# Altium project IOEX V1R0.PrjPcb
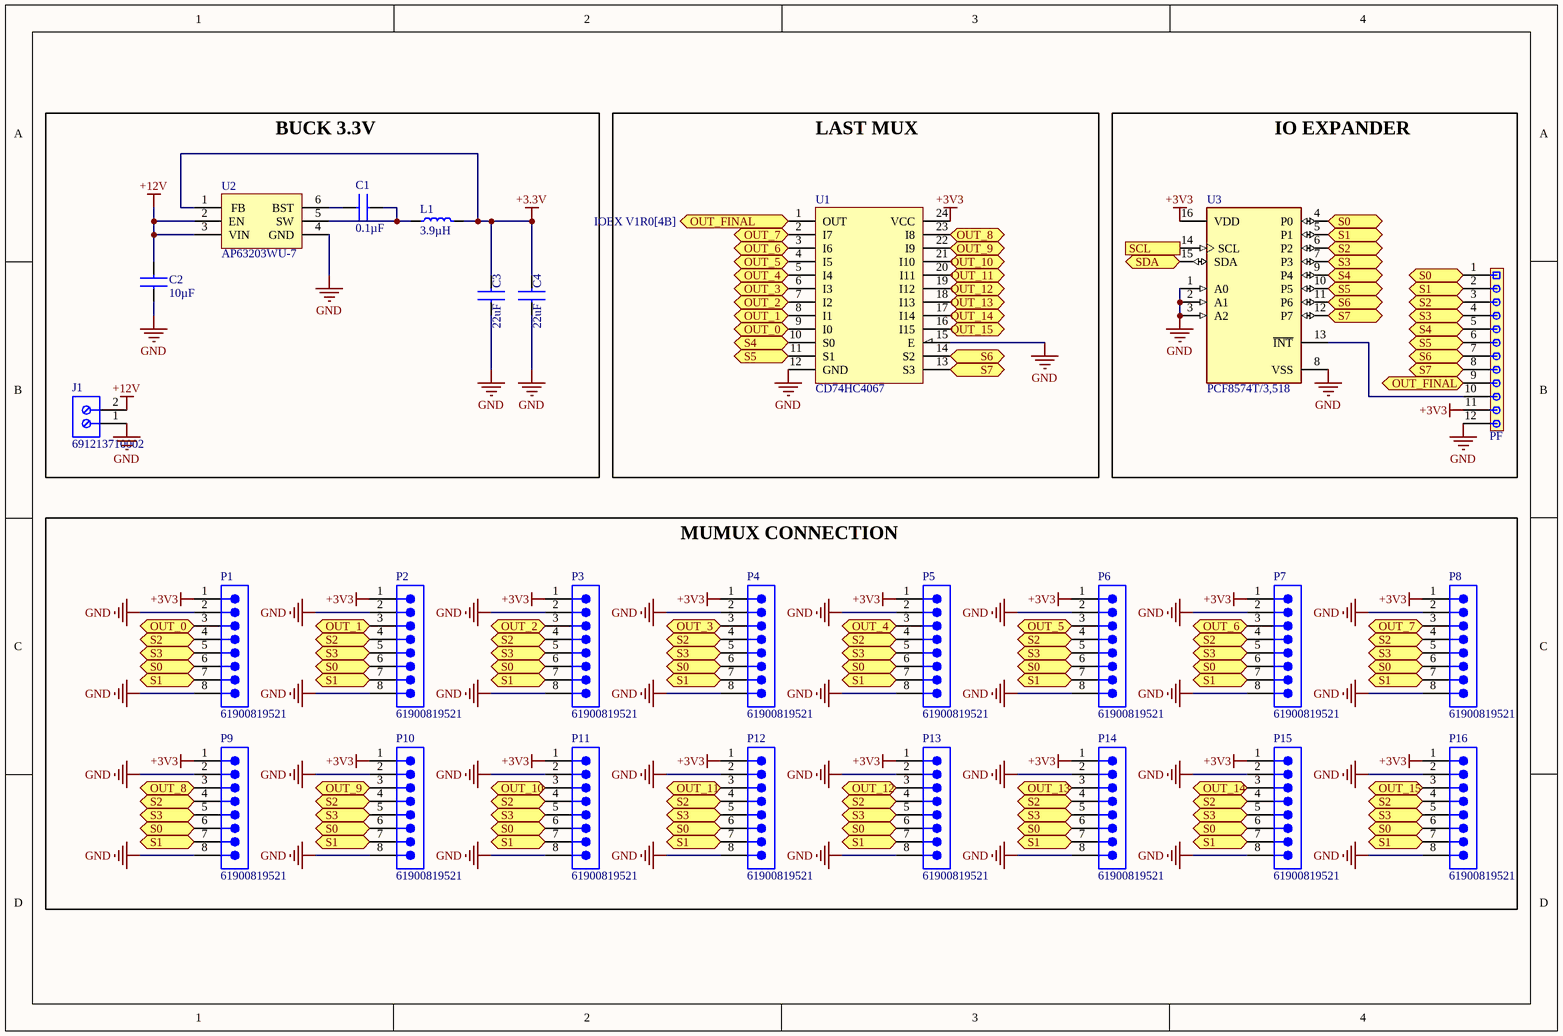
[diagram p0: IOEX V1R0.SchDoc]
1 sheet, 26 parts. Net scope: flat (ports and power ports of the same name join across sheets).
Board file: IOEX V1R0.PcbDoc

## Sheet IOEX V1R0.SchDoc
size A4; SheetNumber: 1; SheetTotal: 1

### Parts
C1  0.1µF  [0402-CAP]
C2  10µF  [0805-CAP]
C3  22uF  [0603-CAP]
C4  22uF  [0603-CAP]
J1  691213710002  [691213710002]
L1  3.9µH  [IND (4.8 x 4.8)]
P1  61900819521  [61900819521]
P2  61900819521  [61900819521]
P3  61900819521  [61900819521]
P4  61900819521  [61900819521]
P5  61900819521  [61900819521]
P6  61900819521  [61900819521]
P7  61900819521  [61900819521]
P8  61900819521  [61900819521]
P9  61900819521  [61900819521]
P10  61900819521  [61900819521]
P11  61900819521  [61900819521]
P12  61900819521  [61900819521]
P13  61900819521  [61900819521]
P14  61900819521  [61900819521]
P15  61900819521  [61900819521]
P16  61900819521  [61900819521]
PF  PH1-12-UA  [2057-PH1-12-UA-ND]  (value not drawn)
U1  CD74HC4067  [SOIC-24]
U2  AP63203WU-7  [SOT-23-6]
U3  PCF8574T/3,518  [FP-SOT162-1-MFG]

### Blocks framed on the sheet
BUCK 3.3V: C1-C4 J1 L1 U2
LAST MUX: U1
IO EXPANDER: PF U3
MUMUX CONNECTION: P1-P16

### Ports
OUT_0 (bidir, see IOEX V1R0[1C]), OUT_0 (bidir, see IOEX V1R0[2B]), OUT_1 (bidir, see IOEX V1R0[1C]), OUT_1 (bidir, see IOEX V1R0[2B]), OUT_2 (bidir, see IOEX V1R0[2B]), OUT_2 (bidir, see IOEX V1R0[2C]), OUT_3 (bidir, see IOEX V1R0[2B]), OUT_3 (bidir, see IOEX V1R0[2C]), OUT_4 (bidir, see IOEX V1R0[2B]), OUT_4 (bidir, see IOEX V1R0[3C]), OUT_5 (bidir, see IOEX V1R0[2B]), OUT_5 (bidir, see IOEX V1R0[3C]), OUT_6 (bidir, see IOEX V1R0[2A]), OUT_6 (bidir, see IOEX V1R0[4C]), OUT_7 (bidir, see IOEX V1R0[2A]), OUT_7 (bidir, see IOEX V1R0[4C]), OUT_8 (bidir, see IOEX V1R0[1D]), OUT_8 (bidir, see IOEX V1R0[3A]), OUT_9 (bidir, see IOEX V1R0[1D]), OUT_9 (bidir, see IOEX V1R0[3A]), OUT_10 (bidir, see IOEX V1R0[2D]), OUT_10 (bidir, see IOEX V1R0[3B]), OUT_11 (bidir, see IOEX V1R0[2D]), OUT_11 (bidir, see IOEX V1R0[3B]), OUT_12 (bidir, see IOEX V1R0[3B]), OUT_12 (bidir, see IOEX V1R0[3D]), OUT_13 (bidir, see IOEX V1R0[3B]), OUT_13 (bidir, see IOEX V1R0[3D]), OUT_14 (bidir, see IOEX V1R0[3B]), OUT_14 (bidir, see IOEX V1R0[4D]), OUT_15 (bidir, see IOEX V1R0[3B]), OUT_15 (bidir, see IOEX V1R0[4D]), OUT_FINAL (bidir, see IOEX V1R0[2A]), OUT_FINAL (bidir, see IOEX V1R0[4B]), S0 (bidir, see IOEX V1R0[1C], IOEX V1R0[1D], IOEX V1R0[2C], IOEX V1R0[2D], IOEX V1R0[3C], IOEX V1R0[3D], IOEX V1R0[4A], IOEX V1R0[4B], IOEX V1R0[4C], IOEX V1R0[4D]), S0 (bidir, see IOEX V1R0[1C], IOEX V1R0[1D], IOEX V1R0[2C], IOEX V1R0[2D], IOEX V1R0[3C], IOEX V1R0[3D], IOEX V1R0[4A], IOEX V1R0[4C], IOEX V1R0[4D]), S0 (bidir, see IOEX V1R0[1C], IOEX V1R0[1D], IOEX V1R0[2C], IOEX V1R0[2D], IOEX V1R0[3C], IOEX V1R0[3D], IOEX V1R0[4B], IOEX V1R0[4C], IOEX V1R0[4D]), S1 (bidir, see IOEX V1R0[1C], IOEX V1R0[1D], IOEX V1R0[2C], IOEX V1R0[2D], IOEX V1R0[3C], IOEX V1R0[3D], IOEX V1R0[4A], IOEX V1R0[4B], IOEX V1R0[4C], IOEX V1R0[4D]), S1 (bidir, see IOEX V1R0[1C], IOEX V1R0[1D], IOEX V1R0[2C], IOEX V1R0[2D], IOEX V1R0[3C], IOEX V1R0[3D], IOEX V1R0[4A], IOEX V1R0[4C], IOEX V1R0[4D]), S1 (bidir, see IOEX V1R0[1C], IOEX V1R0[1D], IOEX V1R0[2C], IOEX V1R0[2D], IOEX V1R0[3C], IOEX V1R0[3D], IOEX V1R0[4B], IOEX V1R0[4C], IOEX V1R0[4D]), S2 (bidir, see IOEX V1R0[1C], IOEX V1R0[1D], IOEX V1R0[2C], IOEX V1R0[2D], IOEX V1R0[3C], IOEX V1R0[3D], IOEX V1R0[4A], IOEX V1R0[4B], IOEX V1R0[4C], IOEX V1R0[4D]), S2 (bidir, see IOEX V1R0[1C], IOEX V1R0[1D], IOEX V1R0[2C], IOEX V1R0[2D], IOEX V1R0[3C], IOEX V1R0[3D], IOEX V1R0[4A], IOEX V1R0[4C], IOEX V1R0[4D]), S2 (bidir, see IOEX V1R0[1C], IOEX V1R0[1D], IOEX V1R0[2C], IOEX V1R0[2D], IOEX V1R0[3C], IOEX V1R0[3D], IOEX V1R0[4B], IOEX V1R0[4C], IOEX V1R0[4D]), S3 (bidir, see IOEX V1R0[1C], IOEX V1R0[1D], IOEX V1R0[2C], IOEX V1R0[2D], IOEX V1R0[3C], IOEX V1R0[3D], IOEX V1R0[4B], IOEX V1R0[4C], IOEX V1R0[4D]), S4 (bidir, see IOEX V1R0[2B], IOEX V1R0[4B]), S4 (bidir, see IOEX V1R0[4B]), S5 (bidir, see IOEX V1R0[2B], IOEX V1R0[4B]), S5 (bidir, see IOEX V1R0[4B]), S6 (bidir, see IOEX V1R0[3B], IOEX V1R0[4B]), S6 (bidir, see IOEX V1R0[4B]), S7 (bidir, see IOEX V1R0[3B], IOEX V1R0[4B]), S7 (bidir, see IOEX V1R0[4B]), SCL (in), SDA (bidir)

### Nets
+3.3V: C3.1 C4.1 L1.2 U2.1(FB)
+3V3: P1.1 P2.1 P3.1 P4.1 P5.1 P6.1 P7.1 P8.1 P9.1 P10.1 P11.1 P12.1 P13.1 P14.1 P15.1 P16.1 PF.11 U1.24(VCC) U3.16(VDD)
+12V: C2.1 J1.2 U2.2(EN) U2.3(VIN)
GND: C2.2 C3.2 C4.2 J1.1 P1.2 P1.8 P2.2 P2.8 P3.2 P3.8 P4.2 P4.8 P5.2 P5.8 P6.2 P6.8 P7.2 P7.8 P8.2 P8.8 P9.2 P9.8 P10.2 P10.8 P11.2 P11.8 P12.2 P12.8 P13.2 P13.8 P14.2 P14.8 P15.2 P15.8 P16.2 P16.8 PF.12 U1.12(GND) U1.15(E) U2.4(GND) U3.1(A0) U3.2(A1) U3.3(A2) U3.8(VSS)
NetC1_1: C1.1 U2.6(BST)
NetC1_2: C1.2 L1.1 U2.5(SW)
NetP1_3: P1.3 U1.9(I0) ; port OUT_0
NetP1_4: P1.4 P2.4 P3.4 P4.4 P5.4 P6.4 P7.4 P8.4 P9.4 P10.4 P11.4 P12.4 P13.4 P14.4 P15.4 P16.4 PF.3 U3.6(P2) ; port S2
NetP1_5: P1.5 P2.5 P3.5 P4.5 P5.5 P6.5 P7.5 P8.5 P9.5 P10.5 P11.5 P12.5 P13.5 P14.5 P15.5 P16.5 PF.4 U3.7(P3) ; port S3
NetP1_6: P1.6 P2.6 P3.6 P4.6 P5.6 P6.6 P7.6 P8.6 P9.6 P10.6 P11.6 P12.6 P13.6 P14.6 P15.6 P16.6 PF.1 U3.4(P0) ; port S0
NetP1_7: P1.7 P2.7 P3.7 P4.7 P5.7 P6.7 P7.7 P8.7 P9.7 P10.7 P11.7 P12.7 P13.7 P14.7 P15.7 P16.7 PF.2 U3.5(P1) ; port S1
NetP2_3: P2.3 U1.8(I1) ; port OUT_1
NetP3_3: P3.3 U1.7(I2) ; port OUT_2
NetP4_3: P4.3 U1.6(I3) ; port OUT_3
NetP5_3: P5.3 U1.5(I4) ; port OUT_4
NetP6_3: P6.3 U1.4(I5) ; port OUT_5
NetP7_3: P7.3 U1.3(I6) ; port OUT_6
NetP8_3: P8.3 U1.2(I7) ; port OUT_7
NetP9_3: P9.3 U1.23(I8) ; port OUT_8
NetP10_3: P10.3 U1.22(I9) ; port OUT_9
NetP11_3: P11.3 U1.21(I10) ; port OUT_10
NetP12_3: P12.3 U1.20(I11) ; port OUT_11
NetP13_3: P13.3 U1.19(I12) ; port OUT_12
NetP14_3: P14.3 U1.18(I13) ; port OUT_13
NetP15_3: P15.3 U1.17(I14) ; port OUT_14
NetP16_3: P16.3 U1.16(I15) ; port OUT_15
NetPF_5: PF.5 U1.10(S0) U3.9(P4) ; port S4
NetPF_6: PF.6 U1.11(S1) U3.10(P5) ; port S5
NetPF_7: PF.7 U1.14(S2) U3.11(P6) ; port S6
NetPF_8: PF.8 U1.13(S3) U3.12(P7) ; port S7
NetPF_9: PF.9 U1.1(OUT) ; port OUT_FINAL
NetPF_10: PF.10 U3.13(~{INT})
NetU3_14: U3.14(SCL) ; port SCL
NetU3_15: U3.15(SDA) ; port SDA

### Library data of the parts
C1 = GRM155R71E104KE14J: CAP CER 0.1UF 25V X7R 0402; Manufacturer 1: Murata; Capacitance: 100nF; Tolerance: 10%; Supplier 1: Digi-Key; Supplier Part Number 1: 490-14603-1-ND; Manufacturer Part Number 1: GRM155R71E104KE14J; RoHS: Yes; Category: Ceramic Capacitors; Stock 1: 176945; Pricing 1: 1=0,10000, 10=0,03100, 100=0,01360, 500=0,00974, 1000=0,00765, 2500=0,00696, 5000=0,00640 (USD); Mount: Surface Mount; Case/Package: 0402; Weight: 0.000212oz; Case Code (Imperial): 0402; Case Code (Metric): 1005; Min Operating Temperature: -55°C; Max Operating Temperature: 125°C; Packaging: Tape and Reel; Voltage Rating: 25V; Dielectric: X7R; Termination: SMD/SMT; Composition: Ceramic; Voltage Rating (DC): 25V; Package Quantity: 50000; Length: 0.039inch; Height: 0.5mm; Width: 0.5mm; Thickness: 0.022inch; ComponentLink1URL: http://www.mouser.com/ds/2/281/c02e-2905.pdf?src-supplier=Mouser; ComponentLink1Description: http://www.mouser.com/ds/2/281/c02e-2905.pdf?src-supplier=Mouser; ComponentLink2URL: http://search.murata.co.jp/Ceramy/image/img/A01X/G101/ENG/GRM155R71E104KE14-01.pdf?src-supplier=Digi-Key; ComponentLink2Description: http://search.murata.co.jp/Ceramy/image/img/A01X/G101/ENG/GRM155R71E104KE14-01.pdf?src-supplier=Digi-Key
C2 = GRM21BR61E106KA73K: CAP CER 10UF 25V X5R 0805; Manufacturer: Murata; Tolerance: 10%; Supplier 1: Digi-Key; Manufacturer Part Number: GRM21BR61E106KA73K; Stock 1: 118823; Pricing 1: 1 = 0,47000, 10 = 0,32500, 100 = 0,19510, 500 = 0,14630, 1000 = 0,12354, 2500 = 0,11704, 5000 = 0,11054 (USD); RoHS: Yes; Mount: Surface Mount; Case/Package: 0805; Weight: 0.000335oz; Min Operating Temperature: -55°C; Max Operating Temperature: 85°C; Packaging: Tape and Reel; Capacitance: 10uF; Voltage Rating: 25V; Package Quantity: 10000; Dielectric: X5R; Voltage Rating (DC): 25V; Length: 0.079inch; Width: 0.049inch; Thickness: 0.055inch; ComponentLink1URL: http://www.mouser.com/ds/2/281/c02e-2905.pdf?src-supplier=Mouser; ComponentLink1Description: http://www.mouser.com/ds/2/281/c02e-2905.pdf?src-supplier=Mouser; ComponentLink2URL: http://search.murata.co.jp/Ceramy/image/img/A01X/G101/ENG/GRM21BR61E106KA73-01.pdf?src-supplier=Digi-Key; ComponentLink2Description: http://search.murata.co.jp/Ceramy/image/img/A01X/G101/ENG/GRM21BR61E106KA73-01.pdf?src-supplier=Digi-Key; ComponentLink3URL: https://search.murata.co.jp/Ceramy/image/img/A01X/G101/ENG/GRM21BR61E106KA73-01.pdf?src-supplier=Digi-Key; ComponentLink3Description: https://search.murata.co.jp/Ceramy/image/img/A01X/G101/ENG/GRM21BR61E106KA73-01.pdf?src-supplier=Digi-Key; Supplier Part Number 1: 490-16824-1-ND
C3 C4 = GRM188R60J226MEA0D: CAP CER 22UF 6.3V X5R 0603; Manufacturer: Murata; Tolerance: 20%; ComponentLink1URL: https://datasheet.ciiva.com/29540/partnumbering-e-01-29540441.pdf?src-supplier=Digi-Key; ComponentLink1Description: https://datasheet.ciiva.com/29540/partnumbering-e-01-29540441.pdf?src-supplier=Digi-Key; ComponentLink2URL: https://datasheet.ciiva.com/29540/partnumbering-e-01-29540442.pdf?src-supplier=Digi-Key; ComponentLink2Description: https://datasheet.ciiva.com/29540/partnumbering-e-01-29540442.pdf?src-supplier=Digi-Key; ComponentLink3URL: https://datasheet.ciiva.com/29540/partnumbering-e-01-29540443.pdf?src-supplier=Digi-Key; ComponentLink3Description: https://datasheet.ciiva.com/29540/partnumbering-e-01-29540443.pdf?src-supplier=Digi-Key; Supplier 1: Digi-Key; Manufacturer Part Number: GRM188R60J226MEA0D; Stock 1: 5241613; Pricing 1: 1=0,28000, 10=0,19400, 100=0,11000, 500=0,07764, 1000=0,06794 (USD); RoHS: Yes; Mount: Surface Mount; Case/Package: 0603; Weight: 0.000222oz; Case Code (Metric): 1608; Case Code (Imperial): 0603; Min Operating Temperature: -55°C; Max Operating Temperature: 85°C; Capacitance: 22uF; Packaging: Tape and Reel; Package Quantity: 4000; Voltage Rating: 6.3V; Dielectric: X5R; Termination: SMD/SMT; Voltage Rating (DC): 6.3V; Length: 1.6mm; Height: 0.8mm; Width: 0.8mm; Thickness: 0.039inch; Depth: 0.8mm; REACH SVHC: No SVHC; Lead Free: Lead Free; Supplier Part Number 1: 490-7611-1-ND
J1 = CMP-1502-02526-2: NexarPartId: 8917718; Number of Contacts: 2; Current Rating: 10A; Stripping Length: -7mm; Wire Gauge (Max): 26AWG; Plating: Brass, Steel; Wire Gauge (Min): 16AWG; Voltage: 300V; Number of Levels: 1; Pitch: 5.0038mm; Color: Green; Number of Pins: 2; Housing Material: Nylon; Termination: Screw; Max Operating Temperature: 105°C; Min Operating Temperature: -40°C; Packaging: Box; Current: 10A; REACH SVHC: Unknown; Width: 10.6mm; RoHS: Compliant; Mount: Through Hole; Height: 10mm; Contact Material: Brass; Length: 8.3mm; Lead Pitch: 5mm; Wire/Cable Gauge: 26AWG; Voltage Rating: 300V; Number of Positions Per Level: 2; Contact Plating: Tin
L1 = SRR4828A-3R9Y: FIXED IND 3.9UH 3.4A 47 MOHM SMD; Manufacturer 1: Bourns; Core Material: Ferrite; Inductance: 15uH; Tolerance: 20%; Current Rating: 1.8A; Saturation Current: 920mA; Shielding: Shielded; DC Resistance (DCR): 145mR; Self Resonant Frequency: 25MHz; Test Frequency: 100kHz; Supplier 1: Digi-Key; Manufacturer Part Number 1: SRR4828A-3R9Y; RoHS: No; Category: Fixed Inductors; Stock 1: 1233; Pricing 1: 1=0,97000, 10=0,84500, 100=0,60380 (USD); Mount: Surface Mount; Case/Package: Nonstandard; Min Operating Temperature: -40°C; Max Operating Temperature: 150°C; Composition: Wirewound; Packaging: Cut Tape; Ratings: AEC-Q200; ComponentLink1URL: http://www.farnell.com/datasheets/2339105.pdf?src-supplier=Farnell; ComponentLink1Description: http://www.farnell.com/datasheets/2339105.pdf?src-supplier=Farnell; ComponentLink2URL: https://www.bourns.com/docs/Product-Datasheets/SRR4828A.pdf?src-supplier=Digi-Key; ComponentLink2Description: https://www.bourns.com/docs/Product-Datasheets/SRR4828A.pdf?src-supplier=Digi-Key; Supplier Part Number 1: SRR4828A-3R9YCT-ND
P1-P16 = CMP-1502-00604-2: NexarPartId: 116664062; Gender: Male; Insulation Resistance: 1GΩ; Current Rating: 3A; Pitch: 2.54mm; Contact Plating: Tin; Length: 20.32mm; Max Operating Temperature: 105°C; Number of Pins: 8; Min Operating Temperature: -40°C; RoHS: Compliant
PF = PH1-12-UA: CONN HEADER VERT 12POS 2.54MM; Manufacturer 1: Adam Equipment; Number of Positions: 12; Voltage Rating (AC): 250V; ComponentLink1URL: https://media.digikey.com/pdf/Data%20Sheets/Sullins%20PDFs/Female_Headers.100_DS.pdf?src-supplier=Digi-Key; ComponentLink1Description: https://media.digikey.com/pdf/Data%20Sheets/Sullins%20PDFs/Female_Headers.100_DS.pdf?src-supplier=Digi-Key; Supplier 1: Digikey; Manufacturer Part  1: PH1-12-UA; RoHS: Yes; Category: Headers and Wire Housings; Stock 1: 7054; Pricing 1: 1=0,22, 10=0,168, 100=0,128, 500=0,10648, 1000=0,09856, 5000=0,08288, 10000=0,07715 (USD); Mounting Technology: Through Hole; Contact Material: Brass; Contact Shape: Square; Contact Finish - Mating: GOLD; Insulation Material: PBT; Insulation Color: Black; Min Operating Temperature: -40°C; Max Operating Temperature: 105°C; Connector Type: Header; Fastening Type: Pull; Series: PH1; Packaging: Bulk; Contact Type: Male Pin; Number of Rows: 1; Termination: Solder; Lead Free: Lead Free; Flammability Rating: UL94 V-0; ComponentLink2URL: https://datasheet.ciiva.com/16480/page-312-315-16480233.pdf?src-supplier=Future+Electronics; ComponentLink2Description: https://datasheet.ciiva.com/16480/page-312-315-16480233.pdf?src-supplier=Future+Electronics; Supplier Part Number 1: 2057-PH1-12-UA-ND
U1 = CD74HC4067: IC MUX/DEMUX 16X1 24SOIC; Manufacturer 1: Texas Instruments; Manufacturer Part  1: CD74HCT4067ME4; Bandwidth: 89MHz; Propagation Delay: 15ns; Number of Channels: 1; Min Supply Voltage: 4.5V; Max Supply Voltage: 5.5V; Nominal Supply Current: 8uA; Number of Bits: 16; Low Level Output Current: 25mA; ComponentLink1URL: https://datasheet.ciiva.com/15092/getdatasheetpartid-517315-15092547.pdf?src-supplier=Verical; ComponentLink1Description: https://datasheet.ciiva.com/15092/getdatasheetpartid-517315-15092547.pdf?src-supplier=Verical; ComponentLink2URL: https://datasheet.ciiva.com/6619/cd4514b-6619129.pdf?src-supplier=Digi-Key; ComponentLink2Description: https://datasheet.ciiva.com/6619/cd4514b-6619129.pdf?src-supplier=Digi-Key; ComponentLink3URL: https://datasheet.ciiva.com/6619/cd4514b-6619130.pdf?src-supplier=Digi-Key; ComponentLink3Description: https://datasheet.ciiva.com/6619/cd4514b-6619130.pdf?src-supplier=Digi-Key; ComponentLink4URL: https://datasheet.ciiva.com/6619/cd4514b-6619131.pdf?src-supplier=Digi-Key; ComponentLink4Description: https://datasheet.ciiva.com/6619/cd4514b-6619131.pdf?src-supplier=Digi-Key; ComponentLink5URL: https://datasheet.ciiva.com/14294/cd4515b-mil-14294557.pdf?src-supplier=Avnet; ComponentLink5Description: https://datasheet.ciiva.com/14294/cd4515b-mil-14294557.pdf?src-supplier=Avnet; ComponentLink6URL: https://datasheet.ciiva.com/28433/cd4515b-mil-28433832.pdf?src-supplier=Avnet+Europe; ComponentLink6Description: https://datasheet.ciiva.com/28433/cd4515b-mil-28433832.pdf?src-supplier=Avnet+Europe; Supplier 1: Arrow Electronics; RoHS: Yes; Category: Interface ICs; Pricing 1: 1000=0,4986, 2000=0,4936, 3000=0,4887, 4000=0,4838, 5000=0,479, 10000=0,4742, 20000=0,4694, 25000=0,4647, 50000=0,4601 (USD); Mounting Technology: Surface Mount; Case/Package: SOIC; Pins: 24; Weight: 0.022025oz; Contact Plating: Gold; Min Operating Temperature: -55°C; Max Operating Temperature: 125°C; Packaging: Rail/Tube; Package Quantity: 25; Series: -; High Level Output Current: 25mA; Number of Circuits: 1; -3db Bandwidth: 89MHz; Operating Supply Current: 8uA; RoHS Compliant: Yes; Lead Free: Lead Free; ComponentLink7URL: http://components.arrow.com/part/dataview/41680261S405991N2413?src-supplier=Arrow+Electronics; ComponentLink7Description: http://components.arrow.com/part/dataview/41680261S405991N2413?src-supplier=Arrow+Electronics; ComponentLink8URL: http://www.ti.com/general/docs/suppproductinfo.tsp?distId=10&amp;gotoUrl=http%3A%2F%2Fwww.ti.com%2Flit%2Fgpn%2Fcd74hct4067&src-supplier=Digikey; ComponentLink8Description: http://www.ti.com/general/docs/suppproductinfo.tsp?distId=10&amp;gotoUrl=http%3A%2F%2Fwww.ti.com%2Flit%2Fgpn%2Fcd74hct4067&src-supplier=Digikey; ComponentLink9URL: http://www.ti.com/general/docs/lit/getliterature.tsp?genericPartNumber=CD74HCT4067&&fileType=pdf&src-supplier=Avnet; ComponentLink9Description: http://www.ti.com/general/docs/lit/getliterature.tsp?genericPartNumber=CD74HCT4067&&fileType=pdf&src-supplier=Avnet; ComponentLink10URL: http://www.ti.com/lit/gpn/cd74hct4067?src-supplier=Mouser; ComponentLink10Description: http://www.ti.com/lit/gpn/cd74hct4067?src-supplier=Mouser; Supplier Part Number 1: CD74HCT4067ME4
U2 = AP63203WU-7: IC REG BUCK 3.3V 2A TSOT26; Manufacturer 1: Diodes; Supplier 1: Digi-Key; Manufacturer Part Number 1: AP63203WU-7; RoHS: No; Stock 1: 11422; Pricing 1: 1=0,83000, 10=0,74500, 25=0,70720, 100=0,54290, 250=0,47976, 500=0,45450, 1000=0,35350 (USD); Supplier Part Number 1: AP63203WU-7DICT-ND
U3 = CMP-10112-000010-1: IC I/O EXPANDER I2C 8B 16SOIC; Manufacturer: NXP Semiconductors; Frequency: 100kHz; Description: I/O Expander 8 I²C 100kHz 16-SO; Max Supply Voltage: 6V; Standoff Height: 0.1mm; Nominal Supply Current: 40uA; Max Junction Temp: +125°C; Min Supply Voltage: 2.5V; Number Of I/Os: 8; Manufacturer Part Number: PCF8574T/3,518; Footprint Url: https://www.nxp.com/docs/en/package-information/SOT162-1.pdf; ComponentLink2URL: https://www.nxp.com/docs/en/data-sheet/PCF8574_PCF8574A.pdf; Automotive: No; Digikey Description: IC I/O EXPANDER I2C 8B 16SOIC; Mouser Description: PCF8574 Series 2.5 - 6V Remote 8-bit I/O Expander for I2C-bus - SOIC-16; Ipc Land Pattern Name: SOIC127P1032X265-16; Interface: I2C; Octopart: https://octopart.com/pcf8574t%2F3%2C518-nxp+semiconductors-10470852; Ambient Temperature Range Low: -40°C; Lead Free: Yes; Device Class L2: Interface ICs; Temperature Range High: +85°C; Device Class L1: Integrated Circuits (ICs); Package: SOT162-1; ComponentLink2Description: Datasheet; Device Class L3: I/O Expanders; Temperature: -40°C to +85°C; Ambient Temperature Range High: +85°C; Height: 2.65mm; Category: IC; RoHS: TRUE; Temperature Range Low: -40°C